# Altium schematic sheet as14120_x31_fpga_power_conf.SchDoc
size A2
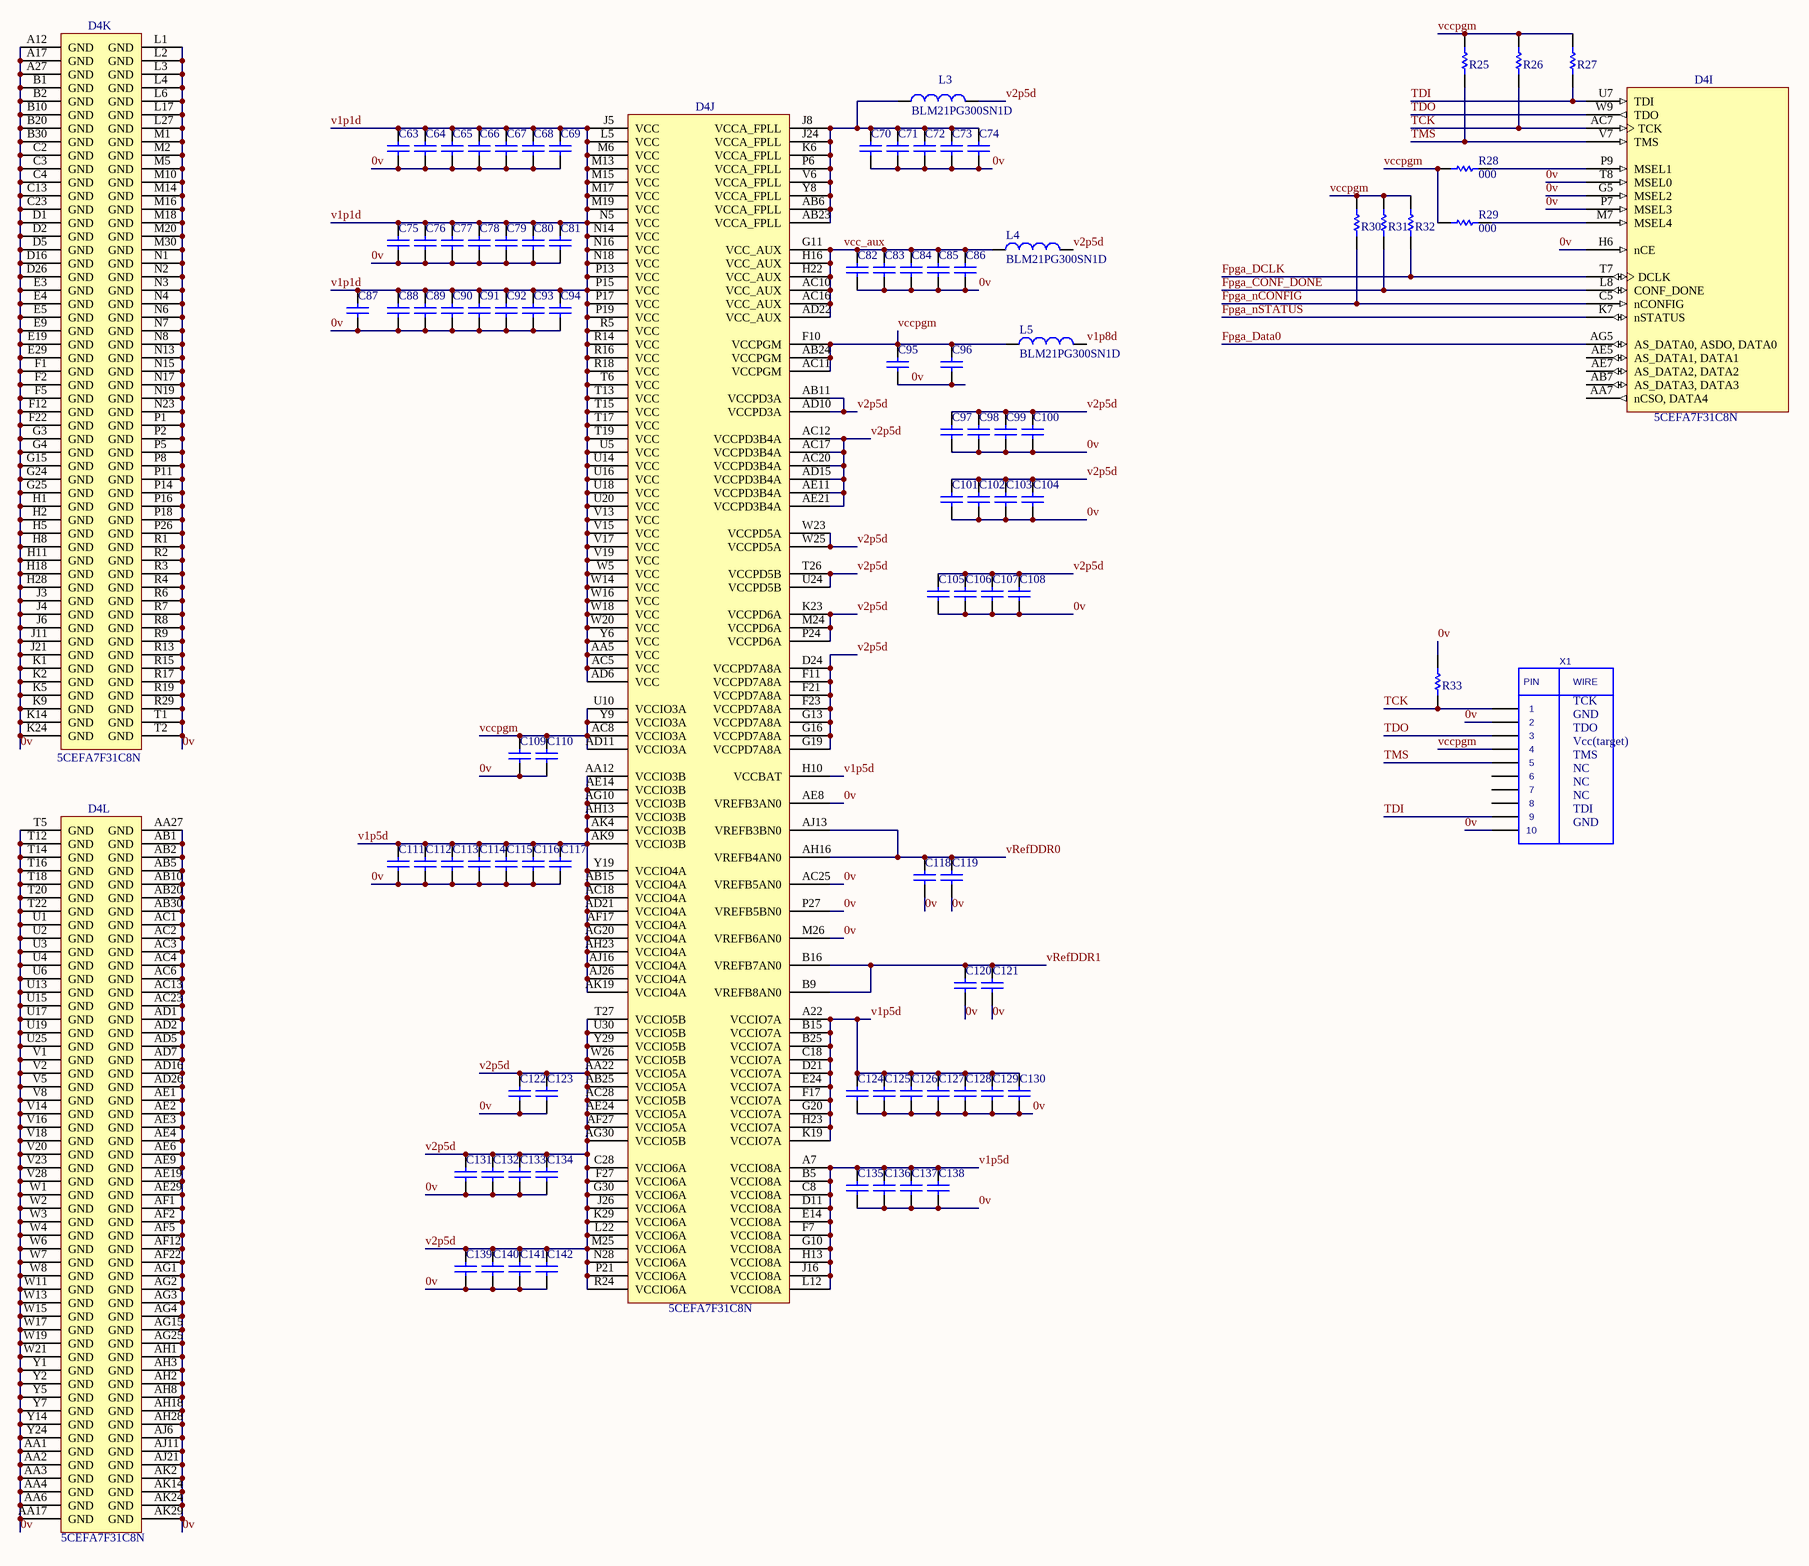
[diagram p0: as14120_x31_fpga_power_conf.SchDoc]

## Parts
C63  CAP 1uF 10V 0402(1005)  [CAPC0402(1005)60_M]  (value not drawn)
C64  CAP 1uF 10V 0402(1005)  [CAPC0402(1005)60_M]  (value not drawn)
C65  CAP 1uF 10V 0402(1005)  [CAPC0402(1005)60_M]  (value not drawn)
C66  CAP 1uF 10V 0402(1005)  [CAPC0402(1005)60_M]  (value not drawn)
C67  CAP 1uF 10V 0402(1005)  [CAPC0402(1005)60_M]  (value not drawn)
C68  CAP 1uF 10V 0402(1005)  [CAPC0402(1005)60_M]  (value not drawn)
C69  CAP 1uF 10V 0402(1005)  [CAPC0402(1005)60_M]  (value not drawn)
C70  CAP 1uF 10V 0402(1005)  [CAPC0402(1005)60_M]  (value not drawn)
C71  CAP 1uF 10V 0402(1005)  [CAPC0402(1005)60_M]  (value not drawn)
C72  CAP 1uF 10V 0402(1005)  [CAPC0402(1005)60_M]  (value not drawn)
C73  CAP 1uF 10V 0402(1005)  [CAPC0402(1005)60_M]  (value not drawn)
C74  CAP 1uF 10V 0402(1005)  [CAPC0402(1005)60_M]  (value not drawn)
C75  CAP 1uF 10V 0402(1005)  [CAPC0402(1005)60_M]  (value not drawn)
C76  CAP 1uF 10V 0402(1005)  [CAPC0402(1005)60_M]  (value not drawn)
C77  CAP 1uF 10V 0402(1005)  [CAPC0402(1005)60_M]  (value not drawn)
C78  CAP 1uF 10V 0402(1005)  [CAPC0402(1005)60_M]  (value not drawn)
C79  CAP 1uF 10V 0402(1005)  [CAPC0402(1005)60_M]  (value not drawn)
C80  CAP 1uF 10V 0402(1005)  [CAPC0402(1005)60_M]  (value not drawn)
C81  CAP 1uF 10V 0402(1005)  [CAPC0402(1005)60_M]  (value not drawn)
C82  CAP 1uF 10V 0402(1005)  [CAPC0402(1005)60_M]  (value not drawn)
C83  CAP 1uF 10V 0402(1005)  [CAPC0402(1005)60_M]  (value not drawn)
C84  CAP 1uF 10V 0402(1005)  [CAPC0402(1005)60_M]  (value not drawn)
C85  CAP 1uF 10V 0402(1005)  [CAPC0402(1005)60_M]  (value not drawn)
C86  CAP 1uF 10V 0402(1005)  [CAPC0402(1005)60_M]  (value not drawn)
C87  CAP 1uF 10V 0402(1005)  [CAPC0402(1005)60_M]  (value not drawn)
C88  CAP 1uF 10V 0402(1005)  [CAPC0402(1005)60_M]  (value not drawn)
C89  CAP 1uF 10V 0402(1005)  [CAPC0402(1005)60_M]  (value not drawn)
C90  CAP 1uF 10V 0402(1005)  [CAPC0402(1005)60_M]  (value not drawn)
C91  CAP 1uF 10V 0402(1005)  [CAPC0402(1005)60_M]  (value not drawn)
C92  CAP 1uF 10V 0402(1005)  [CAPC0402(1005)60_M]  (value not drawn)
C93  CAP 1uF 10V 0402(1005)  [CAPC0402(1005)60_M]  (value not drawn)
C94  CAP 1uF 10V 0402(1005)  [CAPC0402(1005)60_M]  (value not drawn)
C95  CAP 1uF 10V 0402(1005)  [CAPC0402(1005)60_M]  (value not drawn)
C96  CAP 1uF 10V 0402(1005)  [CAPC0402(1005)60_M]  (value not drawn)
C97  CAP 1uF 10V 0402(1005)  [CAPC0402(1005)60_M]  (value not drawn)
C98  CAP 1uF 10V 0402(1005)  [CAPC0402(1005)60_M]  (value not drawn)
C99  CAP 1uF 10V 0402(1005)  [CAPC0402(1005)60_M]  (value not drawn)
C100  CAP 1uF 10V 0402(1005)  [CAPC0402(1005)60_M]  (value not drawn)
C101  CAP 1uF 10V 0402(1005)  [CAPC0402(1005)60_M]  (value not drawn)
C102  CAP 1uF 10V 0402(1005)  [CAPC0402(1005)60_M]  (value not drawn)
C103  CAP 1uF 10V 0402(1005)  [CAPC0402(1005)60_M]  (value not drawn)
C104  CAP 1uF 10V 0402(1005)  [CAPC0402(1005)60_M]  (value not drawn)
C105  CAP 1uF 10V 0402(1005)  [CAPC0402(1005)60_M]  (value not drawn)
C106  CAP 1uF 10V 0402(1005)  [CAPC0402(1005)60_M]  (value not drawn)
C107  CAP 1uF 10V 0402(1005)  [CAPC0402(1005)60_M]  (value not drawn)
C108  CAP 1uF 10V 0402(1005)  [CAPC0402(1005)60_M]  (value not drawn)
C109  CAP 1uF 10V 0402(1005)  [CAPC0402(1005)60_M]  (value not drawn)
C110  CAP 1uF 10V 0402(1005)  [CAPC0402(1005)60_M]  (value not drawn)
C111  CAP 1uF 10V 0402(1005)  [CAPC0402(1005)60_M]  (value not drawn)
C112  CAP 1uF 10V 0402(1005)  [CAPC0402(1005)60_M]  (value not drawn)
C113  CAP 1uF 10V 0402(1005)  [CAPC0402(1005)60_M]  (value not drawn)
C114  CAP 1uF 10V 0402(1005)  [CAPC0402(1005)60_M]  (value not drawn)
C115  CAP 1uF 10V 0402(1005)  [CAPC0402(1005)60_M]  (value not drawn)
C116  CAP 1uF 10V 0402(1005)  [CAPC0402(1005)60_M]  (value not drawn)
C117  CAP 1uF 10V 0402(1005)  [CAPC0402(1005)60_M]  (value not drawn)
C118  CAP 1uF 10V 0402(1005)  [CAPC0402(1005)60_M]  (value not drawn)
C119  CAP 1uF 10V 0402(1005)  [CAPC0402(1005)60_M]  (value not drawn)
C120  CAP 1uF 10V 0402(1005)  [CAPC0402(1005)60_M]  (value not drawn)
C121  CAP 1uF 10V 0402(1005)  [CAPC0402(1005)60_M]  (value not drawn)
C122  CAP 1uF 10V 0402(1005)  [CAPC0402(1005)60_M]  (value not drawn)
C123  CAP 1uF 10V 0402(1005)  [CAPC0402(1005)60_M]  (value not drawn)
C124  CAP 1uF 10V 0402(1005)  [CAPC0402(1005)60_M]  (value not drawn)
C125  CAP 1uF 10V 0402(1005)  [CAPC0402(1005)60_M]  (value not drawn)
C126  CAP 1uF 10V 0402(1005)  [CAPC0402(1005)60_M]  (value not drawn)
C127  CAP 1uF 10V 0402(1005)  [CAPC0402(1005)60_M]  (value not drawn)
C128  CAP 1uF 10V 0402(1005)  [CAPC0402(1005)60_M]  (value not drawn)
C129  CAP 1uF 10V 0402(1005)  [CAPC0402(1005)60_M]  (value not drawn)
C130  CAP 1uF 10V 0402(1005)  [CAPC0402(1005)60_M]  (value not drawn)
C131  CAP 1uF 10V 0402(1005)  [CAPC0402(1005)60_M]  (value not drawn)
C132  CAP 1uF 10V 0402(1005)  [CAPC0402(1005)60_M]  (value not drawn)
C133  CAP 1uF 10V 0402(1005)  [CAPC0402(1005)60_M]  (value not drawn)
C134  CAP 1uF 10V 0402(1005)  [CAPC0402(1005)60_M]  (value not drawn)
C135  CAP 1uF 10V 0402(1005)  [CAPC0402(1005)60_M]  (value not drawn)
C136  CAP 1uF 10V 0402(1005)  [CAPC0402(1005)60_M]  (value not drawn)
C137  CAP 1uF 10V 0402(1005)  [CAPC0402(1005)60_M]  (value not drawn)
C138  CAP 1uF 10V 0402(1005)  [CAPC0402(1005)60_M]  (value not drawn)
C139  CAP 1uF 10V 0402(1005)  [CAPC0402(1005)60_M]  (value not drawn)
C140  CAP 1uF 10V 0402(1005)  [CAPC0402(1005)60_M]  (value not drawn)
C141  CAP 1uF 10V 0402(1005)  [CAPC0402(1005)60_M]  (value not drawn)
C142  CAP 1uF 10V 0402(1005)  [CAPC0402(1005)60_M]  (value not drawn)
D4  5CEFA7F31C8N  [ALTR-896-FBGA-2000A]  (parts I,J,K,L of 13)
L3  BLM21PG300SN1D  [CAPC0805(2012)100_N]
L4  BLM21PG300SN1D  [CAPC0805(2012)100_N]
L5  BLM21PG300SN1D  [CAPC0805(2012)100_N]
R25  1K 5% 0603(1608)  [RESC0603(1608)_L]  (value not drawn)
R26  1K 5% 0603(1608)  [RESC0603(1608)_L]  (value not drawn)
R27  1K 5% 0603(1608)  [RESC0603(1608)_L]  (value not drawn)
R28  value 000  [RESC0603(1608)_L]  (hidden comment: 1K 5% 0603(1608))
R29  value 000  [RESC0603(1608)_L]  (hidden comment: 1K 5% 0603(1608))
R30  1K 5% 0603(1608)  [RESC0603(1608)_L]  (value not drawn)
R31  1K 5% 0603(1608)  [RESC0603(1608)_L]  (value not drawn)
R32  1K 5% 0603(1608)  [RESC0603(1608)_L]  (value not drawn)
R33  1K 5% 0603(1608)  [RESC0603(1608)_L]  (value not drawn)
X1  IDC10  [IDC10M]  (value not drawn)

## Nets
0v: C63.1 C64.1 C65.1 C66.1 C67.1 C68.1 C69.1 C70.1 C71.1 C72.1 C73.1 C74.1 C75.1 C76.1 C77.1 C78.1 C79.1 C80.1 C81.1 C82.1 C83.1 C84.1 C85.1 C86.1 C87.1 C88.1 C89.1 C90.1 C91.1 C92.1 C93.1 C94.1 C95.1 C96.1 C97.1 C98.1 C99.1 C100.1 C101.1 C102.1 C103.1 C104.1 C105.1 C106.1 C107.1 C108.1 C109.1 C110.1 C111.1 C112.1 C113.1 C114.1 C115.1 C116.1 C117.1 C118.1 C119.1 C120.1 C121.1 C122.1 C123.1 C124.1 C125.1 C126.1 C127.1 C128.1 C129.1 C130.1 C131.1 C132.1 C133.1 C134.1 C135.1 C136.1 C137.1 C138.1 C139.1 C140.1 C141.1 C142.1 D4.A12(GND) D4.A17(GND) D4.A27(GND) D4.AA1(GND) D4.AA2(GND) D4.AA3(GND) D4.AA4(GND) D4.AA6(GND) D4.AA17(GND) D4.AA27(GND) D4.AB1(GND) D4.AB2(GND) D4.AB5(GND) D4.AB10(GND) D4.AB20(GND) D4.AB30(GND) D4.AC1(GND) D4.AC2(GND) D4.AC3(GND) D4.AC4(GND) D4.AC6(GND) D4.AC13(GND) D4.AC23(GND) D4.AC25(VREFB5AN0) D4.AD1(GND) D4.AD2(GND) D4.AD5(GND) D4.AD7(GND) D4.AD16(GND) D4.AD26(GND) D4.AE1(GND) D4.AE2(GND) D4.AE3(GND) D4.AE4(GND) D4.AE6(GND) D4.AE8(VREFB3AN0) D4.AE9(GND) D4.AE19(GND) D4.AE29(GND) D4.AF1(GND) D4.AF2(GND) D4.AF5(GND) D4.AF12(GND) D4.AF22(GND) D4.AG1(GND) D4.AG2(GND) D4.AG3(GND) D4.AG4(GND) D4.AG15(GND) D4.AG25(GND) D4.AH1(GND) D4.AH2(GND) D4.AH3(GND) D4.AH8(GND) D4.AH18(GND) D4.AH28(GND) D4.AJ6(GND) D4.AJ11(GND) D4.AJ21(GND) D4.AK2(GND) D4.AK14(GND) D4.AK24(GND) D4.AK29(GND) D4.B1(GND) D4.B2(GND) D4.B10(GND) D4.B20(GND) D4.B30(GND) D4.C2(GND) D4.C3(GND) D4.C4(GND) D4.C13(GND) D4.C23(GND) D4.D1(GND) D4.D2(GND) D4.D5(GND) D4.D16(GND) D4.D26(GND) D4.E3(GND) D4.E4(GND) D4.E5(GND) D4.E9(GND) D4.E19(GND) D4.E29(GND) D4.F1(GND) D4.F2(GND) D4.F5(GND) D4.F12(GND) D4.F22(GND) D4.G3(GND) D4.G4(GND) D4.G5(MSEL2) D4.G15(GND) D4.G24(GND) D4.G25(GND) D4.H1(GND) D4.H2(GND) D4.H5(GND) D4.H6(nCE) D4.H8(GND) D4.H11(GND) D4.H18(GND) D4.H28(GND) D4.J3(GND) D4.J4(GND) D4.J6(GND) D4.J11(GND) D4.J21(GND) D4.K1(GND) D4.K2(GND) D4.K5(GND) D4.K9(GND) D4.K14(GND) D4.K24(GND) D4.L1(GND) D4.L2(GND) D4.L3(GND) D4.L4(GND) D4.L6(GND) D4.L17(GND) D4.L27(GND) D4.M1(GND) D4.M2(GND) D4.M5(GND) D4.M10(GND) D4.M14(GND) D4.M16(GND) D4.M18(GND) D4.M20(GND) D4.M26(VREFB6AN0) D4.M30(GND) D4.N1(GND) D4.N2(GND) D4.N3(GND) D4.N4(GND) D4.N6(GND) D4.N7(GND) D4.N8(GND) D4.N13(GND) D4.N15(GND) D4.N17(GND) D4.N19(GND) D4.N23(GND) D4.P1(GND) D4.P2(GND) D4.P5(GND) D4.P7(MSEL3) D4.P8(GND) D4.P11(GND) D4.P14(GND) D4.P16(GND) D4.P18(GND) D4.P26(GND) D4.P27(VREFB5BN0) D4.R1(GND) D4.R2(GND) D4.R3(GND) D4.R4(GND) D4.R6(GND) D4.R7(GND) D4.R8(GND) D4.R9(GND) D4.R13(GND) D4.R15(GND) D4.R17(GND) D4.R19(GND) D4.R29(GND) D4.T1(GND) D4.T2(GND) D4.T5(GND) D4.T8(MSEL0) D4.T12(GND) D4.T14(GND) D4.T16(GND) D4.T18(GND) D4.T20(GND) D4.T22(GND) D4.U1(GND) D4.U2(GND) D4.U3(GND) D4.U4(GND) D4.U6(GND) D4.U13(GND) D4.U15(GND) D4.U17(GND) D4.U19(GND) D4.U25(GND) D4.V1(GND) D4.V2(GND) D4.V5(GND) D4.V8(GND) D4.V14(GND) D4.V16(GND) D4.V18(GND) D4.V20(GND) D4.V23(GND) D4.V28(GND) D4.W1(GND) D4.W2(GND) D4.W3(GND) D4.W4(GND) D4.W6(GND) D4.W7(GND) D4.W8(GND) D4.W11(GND) D4.W13(GND) D4.W15(GND) D4.W17(GND) D4.W19(GND) D4.W21(GND) D4.Y1(GND) D4.Y2(GND) D4.Y5(GND) D4.Y7(GND) D4.Y14(GND) D4.Y24(GND) R33.1 X1.2 X1.10
Fpga_CONF_DONE: D4.L8(CONF_DONE) R31.2
Fpga_Data0: D4.AG5(AS_DATA0,_ASDO,_DATA0)
Fpga_DCLK: D4.T7(DCLK) R32.2
Fpga_nCONFIG: D4.C5(nCONFIG) R30.2
Fpga_nSTATUS: D4.K7(nSTATUS)
TCK: D4.AC7(TCK) R26.2 R33.2 X1.1
TDI: D4.U7(TDI) R27.1 X1.9
TDO: D4.W9(TDO) X1.3
TMS: D4.V7(TMS) R25.2 X1.5
v1p1d: C63.2 C64.2 C65.2 C66.2 C67.2 C68.2 C69.2 C75.2 C76.2 C77.2 C78.2 C79.2 C80.2 C81.2 C87.2 C88.2 C89.2 C90.2 C91.2 C92.2 C93.2 C94.2 D4.AA5(VCC) D4.AC5(VCC) D4.AD6(VCC) D4.J5(VCC) D4.L5(VCC) D4.M6(VCC) D4.M13(VCC) D4.M15(VCC) D4.M17(VCC) D4.M19(VCC) D4.N5(VCC) D4.N14(VCC) D4.N16(VCC) D4.N18(VCC) D4.P13(VCC) D4.P15(VCC) D4.P17(VCC) D4.P19(VCC) D4.R5(VCC) D4.R14(VCC) D4.R16(VCC) D4.R18(VCC) D4.T6(VCC) D4.T13(VCC) D4.T15(VCC) D4.T17(VCC) D4.T19(VCC) D4.U5(VCC) D4.U14(VCC) D4.U16(VCC) D4.U18(VCC) D4.U20(VCC) D4.V13(VCC) D4.V15(VCC) D4.V17(VCC) D4.V19(VCC) D4.W5(VCC) D4.W14(VCC) D4.W16(VCC) D4.W18(VCC) D4.W20(VCC) D4.Y6(VCC)
v1p5d: C111.2 C112.2 C113.2 C114.2 C115.2 C116.2 C117.2 C124.2 C125.2 C126.2 C127.2 C128.2 C129.2 C130.2 C135.2 C136.2 C137.2 C138.2 D4.A7(VCCIO8A) D4.A22(VCCIO7A) D4.AA12(VCCIO3B) D4.AB15(VCCIO4A) D4.AC18(VCCIO4A) D4.AD21(VCCIO4A) D4.AE14(VCCIO3B) D4.AF17(VCCIO4A) D4.AG10(VCCIO3B) D4.AG20(VCCIO4A) D4.AH13(VCCIO3B) D4.AH23(VCCIO4A) D4.AJ16(VCCIO4A) D4.AJ26(VCCIO4A) D4.AK4(VCCIO3B) D4.AK9(VCCIO3B) D4.AK19(VCCIO4A) D4.B5(VCCIO8A) D4.B15(VCCIO7A) D4.B25(VCCIO7A) D4.C8(VCCIO8A) D4.C18(VCCIO7A) D4.D11(VCCIO8A) D4.D21(VCCIO7A) D4.E14(VCCIO8A) D4.E24(VCCIO7A) D4.F7(VCCIO8A) D4.F17(VCCIO7A) D4.G10(VCCIO8A) D4.G20(VCCIO7A) D4.H10(VCCBAT) D4.H13(VCCIO8A) D4.H23(VCCIO7A) D4.J16(VCCIO8A) D4.K19(VCCIO7A) D4.L12(VCCIO8A) D4.Y19(VCCIO4A)
v1p8d: L5.2
v2p5d: C97.2 C98.2 C99.2 C100.2 C101.2 C102.2 C103.2 C104.2 C105.2 C106.2 C107.2 C108.2 C122.2 C123.2 C131.2 C132.2 C133.2 C134.2 C139.2 C140.2 C141.2 C142.2 D4.AA22(VCCIO5A) D4.AB11(VCCPD3A) D4.AB25(VCCIO5A) D4.AC12(VCCPD3B4A) D4.AC17(VCCPD3B4A) D4.AC20(VCCPD3B4A) D4.AC28(VCCIO5B) D4.AD10(VCCPD3A) D4.AD15(VCCPD3B4A) D4.AE11(VCCPD3B4A) D4.AE21(VCCPD3B4A) D4.AE24(VCCIO5A) D4.AF27(VCCIO5A) D4.AG30(VCCIO5B) D4.C28(VCCIO6A) D4.D24(VCCPD7A8A) D4.F11(VCCPD7A8A) D4.F21(VCCPD7A8A) D4.F23(VCCPD7A8A) D4.F27(VCCIO6A) D4.G13(VCCPD7A8A) D4.G16(VCCPD7A8A) D4.G19(VCCPD7A8A) D4.G30(VCCIO6A) D4.J26(VCCIO6A) D4.K23(VCCPD6A) D4.K29(VCCIO6A) D4.L22(VCCIO6A) D4.M24(VCCPD6A) D4.M25(VCCIO6A) D4.N28(VCCIO6A) D4.P21(VCCIO6A) D4.P24(VCCPD6A) D4.R24(VCCIO6A) D4.T26(VCCPD5B) D4.T27(VCCIO5B) D4.U24(VCCPD5B) D4.U30(VCCIO5B) D4.W23(VCCPD5A) D4.W25(VCCPD5A) D4.W26(VCCIO5B) D4.Y29(VCCIO5B) L3.2 L4.2
vcc_aux: C82.2 C83.2 C84.2 C85.2 C86.2 D4.AC10(VCC_AUX) D4.AC16(VCC_AUX) D4.AD22(VCC_AUX) D4.G11(VCC_AUX) D4.H16(VCC_AUX) D4.H22(VCC_AUX) L4.1
vccpgm: C95.2 C96.2 C109.2 C110.2 D4.AB24(VCCPGM) D4.AC8(VCCIO3A) D4.AC11(VCCPGM) D4.AD11(VCCIO3A) D4.F10(VCCPGM) D4.U10(VCCIO3A) D4.Y9(VCCIO3A) L5.1 R25.1 R26.1 R27.2 R28.2 R29.2 R30.1 R31.1 R32.1 X1.4
vRefDDR0: C118.2 C119.2 D4.AH16(VREFB4AN0) D4.AJ13(VREFB3BN0)
vRefDDR1: C120.2 C121.2 D4.B9(VREFB8AN0) D4.B16(VREFB7AN0)
NetC70_2: C70.2 C71.2 C72.2 C73.2 C74.2 D4.AB6(VCCA_FPLL) D4.AB23(VCCA_FPLL) D4.J8(VCCA_FPLL) D4.J24(VCCA_FPLL) D4.K6(VCCA_FPLL) D4.P6(VCCA_FPLL) D4.V6(VCCA_FPLL) D4.Y8(VCCA_FPLL) L3.1
NetD4_M7: D4.M7(MSEL4) R29.1
NetD4_P9: D4.P9(MSEL1) R28.1

Not connected (* = marked no-connect by the designer): D4 AA7(nCSO,_DATA4) AB7(AS_DATA3,_DATA3) AE5(AS_DATA1,_DATA1) AE7(AS_DATA2,_DATA2); X1 6 7 8

## Notes on the sheet
- TCK
- GND
- TDO
- Vcc(target)
- TMS
- NC
- TDI
- Title
- Size:
- Date:
- File:
- A2
- Number:
- Time:
- Revision:
- Sheet
- of
- (in symbol IDC10) PIN; WIRE

## Library data of the parts
C63-C142 = CAP_0402: CAP 1uF 10V ±20% 0402 (1005 Metric) Thickness 0.6mm SMD; Case-Metric: 1005; Case-EIA: 0402; Value: 0.1; Tolerance: ±20%; Max Thickness: 0.6 mm; Rated Voltage: 10 V; Technology: SMT
D4 = 5CEFA7F31C8N: Cyclone V E Family FPGA, 1.07 to 1.13 V Supply, 480 I/O Pins, 7 PLLs, 896-Pin FBGA, Speed Grade 8, Commercial Grade, RoHS Compliant; Manufacturer: Altera; Device Group: 5CEFA7; GPIO: 480; Logic Elements (LE) (K): 149.5; Speed Grade: 8; DatasheetVersion: Rev. 3.1; PackageReference: 896-FBGA-2000A; PackageDescription: 896-Pin FineLine Ball-Grid Array (FBGA), Body 31 x 31 mm, Pitch 1 mm; Supplier 1: Digi-Key; Supplier Part Number 1: 544-2768-ND; Supplier 2: Mouser; Supplier Part Number 2: 989-5CEFA7F31C8N; RoHS: RoHS Compliant; Subcategory: Cyclone V E; Voltage Supply: 1.07 to 1.13 V; Mounting Technology: Surface Mount; Code_JEDEC: MS-034-AAN-1; PartNumber: 5CEFA7F31C8N; ComponentLink1Description: Manufacturer URL; ComponentLink1URL: http://www.altera.com; ComponentLink2Description: Datasheet; ComponentLink2URL: http://www.altera.com/literature/hb/cyclone-v/cv_51002.pdf; ComponentLink3Description: Package Specification; ComponentLink3URL: http://www.altera.com/devicepackaging/04R00435-01.pdf; ComponentLink4Description: Device Handbook URL; ComponentLink4URL: http://www.altera.com/literature/hb/cyclone-v/cyclone5_handbook.pdf; ComponentLink5Description: Device Overview URL; ComponentLink5URL: http://www.altera.com/literature/hb/cyclone-v/cv_51001.pdf; ComponentLink6Description: Device Pin-Out URL; ComponentLink6URL: http://www.altera.com/literature/dp/cyclone-v/1.1.txt; ComponentLink7Description: Product URL; ComponentLink7URL: http://www.buyaltera.com/scripts/partsearch.dll?Detail&name=5CEFA7F31C8N-ND
L3-L5 = Ferrite_beat
R25-R27 R30-R32 = RES_0603: 1K 0.1W 5% 0603 (1608 Metric)  SMD; Case-EIA: 0603; Case-Metric: 1608; Value: 10k; Technology: SMT; Tolerance: 5 %; Power: 0.1 W
R28 R29 R33 = RES_0603: 1K 0.1W 5% 0603 (1608 Metric)  SMD; Case-EIA: 0603; Case-Metric: 1608; Technology: SMT; Tolerance: 5 %; Power: 0.1 W
  R33: Value: 1k
X1 = IDC10: Value: *